# EAGLE design circuit_R1 (EAGLE 7.6.0)
REV: 1
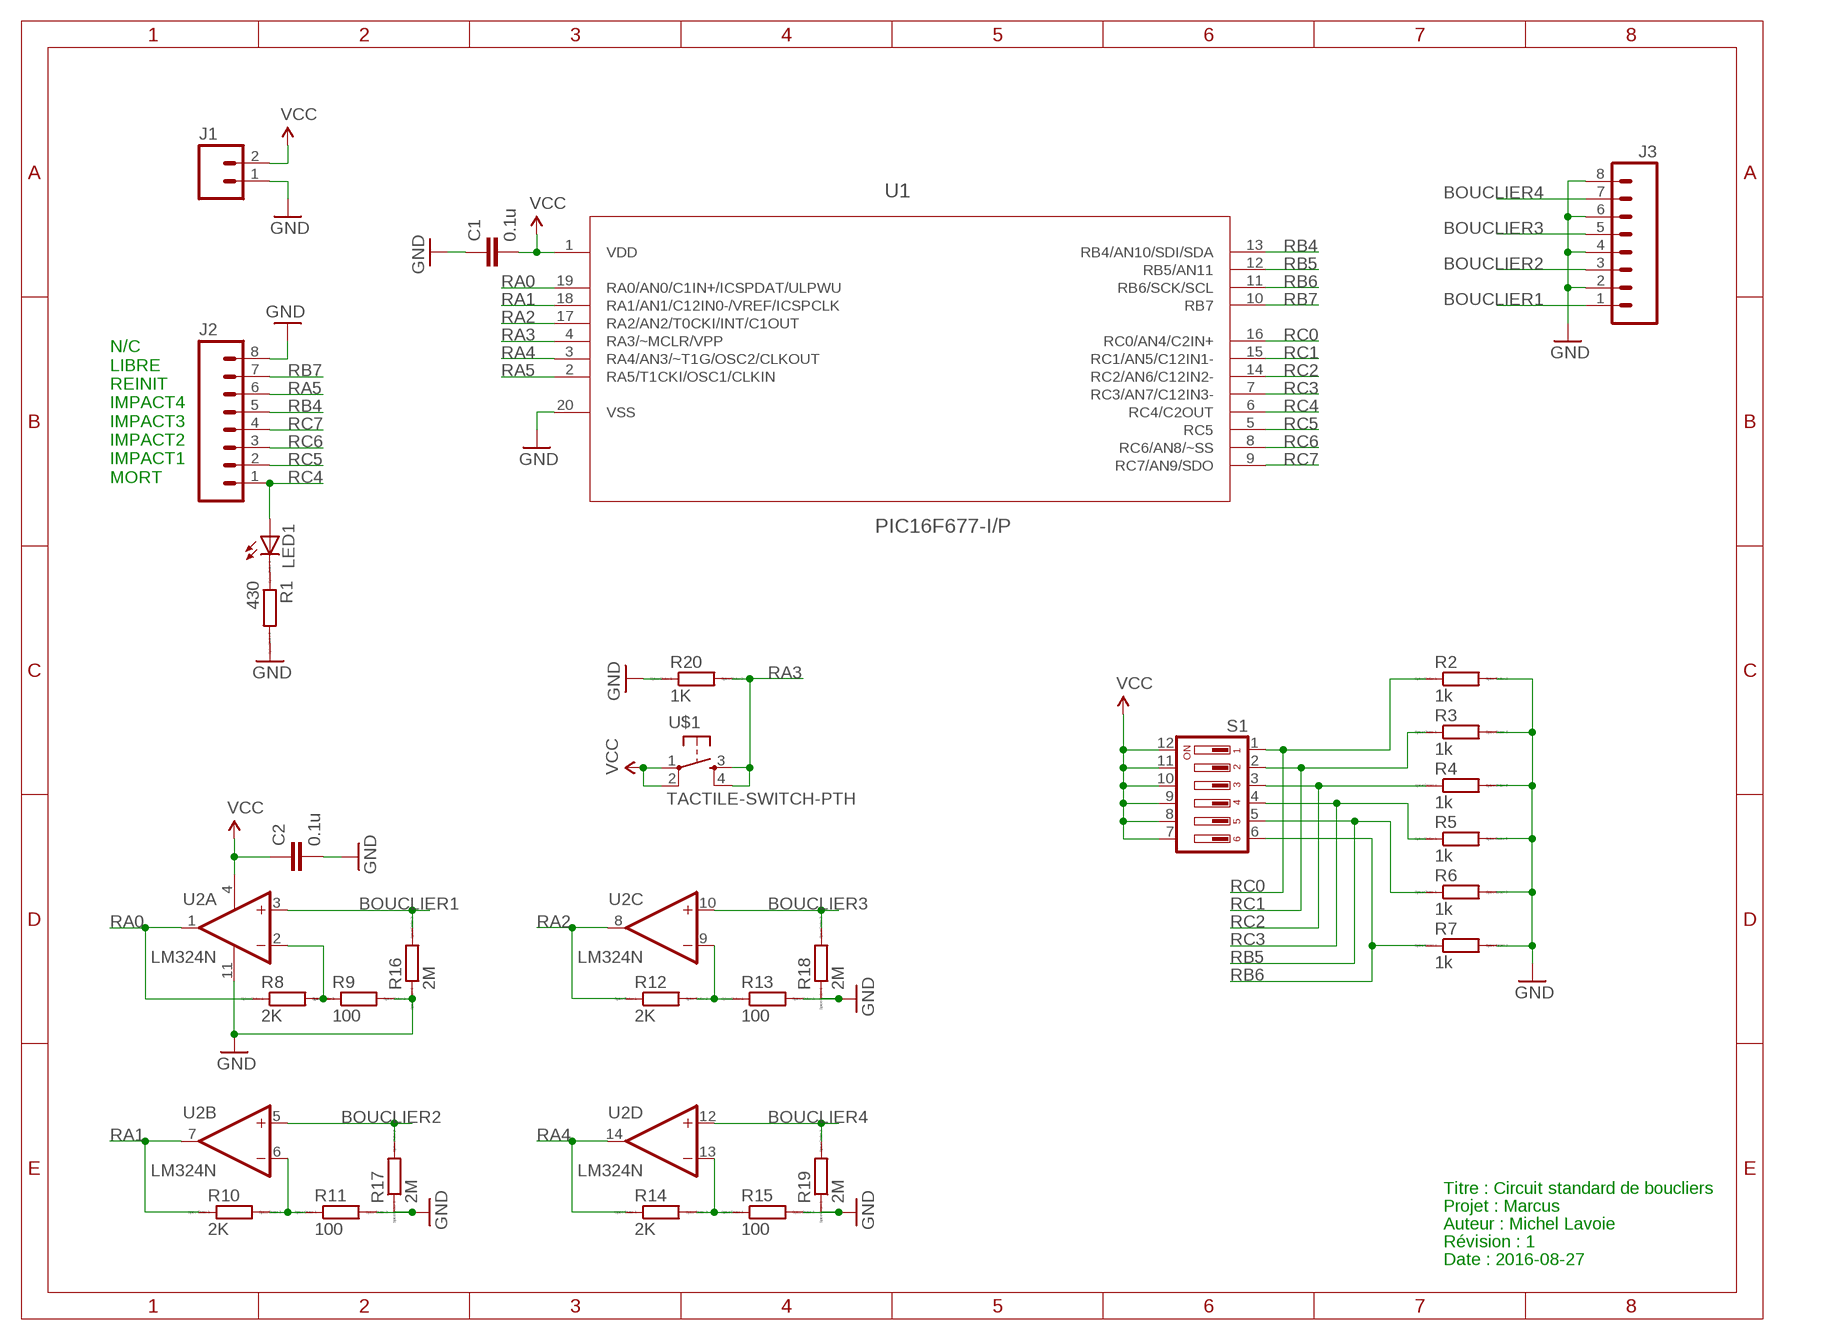
[diagram p0: schematic, sheet 1]

## Parts
C1  0.1u  CAPPTH  [CAP-PTH-SMALL]
C2  0.1u  CAPPTH  [CAP-PTH-SMALL]
J1  M02PTH  [1X02]
J2  M08NO_SILK  [1X08_PIN1_NO_SILK]
J3  M08NO_SILK  [1X08_PIN1_NO_SILK]
LED1  LED3MM  [LED3MM]
R1  430  R0207/10  [0207/10]
R2  1k  R0207/10  [0207/10]
R3  1k  R0207/10  [0207/10]
R4  1k  R0207/10  [0207/10]
R5  1k  R0207/10  [0207/10]
R6  1k  R0207/10  [0207/10]
R7  1k  R0207/10  [0207/10]
R8  2K  R0207/10  [0207/10]
R9  100  R0207/10  [0207/10]
R10  2K  R0207/10  [0207/10]
R11  100  R0207/10  [0207/10]
R12  2K  R0207/10  [0207/10]
R13  100  R0207/10  [0207/10]
R14  2K  R0207/10  [0207/10]
R15  100  R0207/10  [0207/10]
R16  2M  R0207/10  [0207/10]
R17  2M  R0207/10  [0207/10]
R18  2M  R0207/10  [0207/10]
R19  2M  R0207/10  [0207/10]
R20  1K  R0207/10  [0207/10]
S1  DIP06YL  [DIP06YL]
U1  PIC16F677-I/P  [DIP254P762X533-20]
U2  LM324N  [DIL14]
U$1  TACTILE-SWITCH-PTH  [TAC-SWITCH-PTH]

## Nets
5V: C1.2 C2.1 J1.2 S1.7 S1.8 S1.9 S1.10 S1.11 S1.12 U1.1(VDD) U2.4(P:V+) U$1.1 U$1.2 ; supply symbol labelled VCC
BOUCLIER1: J3.1 R16.2 U2.3(A:+IN)
BOUCLIER2: J3.3 R17.2 U2.5(B:+IN)
BOUCLIER3: J3.5 R18.2 U2.10(C:+IN)
BOUCLIER4: J3.7 R19.2 U2.12(D:+IN)
GND: C1.1 C2.2 J1.1 J2.8 J3.2 J3.4 J3.6 J3.8 R1.2 R2.2 R3.2 R4.2 R5.2 R6.2 R7.2 R9.2 R11.2 R13.2 R15.2 R16.1 R17.1 R18.1 R19.1 R20.1 U1.20(VSS) U2.11(P:V-)
N$1: R10.2 R11.1 U2.6(B:-IN)
N$2: LED1.K(C) R1.1
N$3: R8.2 R9.1 U2.2(A:-IN)
N$5: R12.2 R13.1 U2.9(C:-IN)
N$6: R14.2 R15.1 U2.13(D:-IN)
RA0: R8.1 U1.19(RA0/AN0/C1IN+/ICSPDAT/ULPWU) U2.1(A:OUT)
RA1: R10.1 U1.18(RA1/AN1/C12IN0-/VREF/ICSPCLK) U2.7(B:OUT)
RA2: R12.1 U1.17(RA2/AN2/T0CKI/INT/C1OUT) U2.8(C:OUT)
RA3: R20.2 U1.4(RA3/~MCLR/VPP) U$1.3 U$1.4
RA4: R14.1 U1.3(RA4/AN3/~T1G/OSC2/CLKOUT) U2.14(D:OUT)
RA5: J2.6 U1.2(RA5/T1CKI/OSC1/CLKIN)
RB4: J2.5 U1.13(RB4/AN10/SDI/SDA)
RB5: R6.1 S1.5 U1.12(RB5/AN11)
RB6: R7.1 S1.6 U1.11(RB6/SCK/SCL)
RB7: J2.7 U1.10(RB7)
RC0: R2.1 S1.1 U1.16(RC0/AN4/C2IN+)
RC1: R3.1 S1.2 U1.15(RC1/AN5/C12IN1-)
RC2: R4.1 S1.3 U1.14(RC2/AN6/C12IN2-)
RC3: R5.1 S1.4 U1.7(RC3/AN7/C12IN3-)
RC4: J2.1 LED1.A U1.6(RC4/C2OUT)
RC5: J2.2 U1.5(RC5)
RC6: J2.3 U1.8(RC6/AN8/~SS)
RC7: J2.4 U1.9(RC7/AN9/SDO)

## Notes on the sheet
- N/C
  LIBRE
  REINIT
  IMPACT4
  IMPACT3
  IMPACT2
  IMPACT1
  MORT
- Titre : Circuit standard de boucliers
- Projet : Marcus
- Auteur : Michel Lavoie
- Révision : 1
- Date : 2016-08-27

## Library data of the parts
C1 C2 = SparkFun-Capacitors:CAP: Capacitor Standard 0603 ceramic capacitor, and 0.1" leaded capacitor.
J1 = SparkFun-Connectors:M02: Standard 2-pin 0.1" header. Use with - straight break away headers ( PRT-00116) - right angle break away headers (PRT-00553) - swiss pins (PRT-00743) - machine pins (PRT-00117) - female headers (PRT-00115) Molex polarized connector foot print use with: PRT-08233 with associated crimp pins and housings. 2.54_SCREWTERM for use with PRT-10571. 3.5mm Screw Terminal footprints for PRT-08084 5mm Screw Terminal footprints for use with PRT-08432
J2 J3 = SparkFun-Connectors:M08: Header 8 Standard 8-pin 0.1" header. Use with straight break away headers (SKU : PRT-00116), right angle break away headers (PRT-00553), swiss pins (PRT-00743), machine pins (PRT-00117), and female headers (PRT-00115).
LED1 = adafruit:LED: LED OSRAM: - CHIPLED LG R971, LG N971, LY N971, LG Q971, LY Q971, LO R971, LY R971 LH N974, LH R974 LS Q976, LO Q976, LY Q976 LO Q996 - Hyper CHIPLED LW Q18S LB Q993, LB Q99A, LB R99A - SideLED LS A670, LO A670, LY A670, LG A670, LP A670 LB A673, LV A673, LT A673, LW A673 LH A674 LY A675 LS A676, LA A676, LO A676, LY A676, LW A676 LS A679, LY A679, LG A679 - Hyper Micro SIDELED® LS Y876, LA Y876, LO Y876, LY Y876 LT Y87S - SmartLED LW L88C, LW L88S LB L89C, LB L89S, LG L890 LS L89K, LO L89K, LY L89K LS L896, LA L896, LO L896, LY L896 - TOPLED LS T670, LO T670, LY T670, LG T670, LP T670 LSG T670, LSP T670, LSY T670, LOP T670, LYG T670 LG T671, LOG T671, LSG T671 LB T673, LV T673, LT T673, LW T673 LH T674 LS T676, LA T676, LO T676, LY T676, LB T676, LH T676, LSB T676, LW T676 LB T67C, LV T67C, LT T67C, LS T67K, LO T67K, LY T67K, LW E67C LS E67B, LA E67B, LO E67B, LY E67B, LB E67C, LV E67C, LT E67C LW T67C LS T679, LY T679, LG T679 LS T770, LO T770, LY T770, LG T770, LP T770 LB T773, LV T773, LT T773, LW T773 LH T774 LS E675, LA E675, LY E675, LS T675 LS T776, LA T776, LO T776, LY T776, LB T776 LHGB T686 LT T68C, LB T68C - Hyper Mini TOPLED® LB M676 - Mini TOPLED Santana® LG M470 LS M47K, LO M47K, LY M47K Source: http://www.osram.convergy.de/
R1-R20 = eagle-ltspice:R: RESISTOR, European symbol; SPICEMODEL: NONE; SPICEPREFIX: R
S1 = switch-dil:DIP06YL: DIL/CODE SWITCH; OC_FARNELL: unknown; OC_NEWARK: unknown
U1 = Microchip_By_element14_Batch_1:PIC16F677-I/P: 8 Bit CMOS Microcontrollers; MPN: PIC16F677-I/P; OC_FARNELL: 1332206; OC_NEWARK: 56J7509; PACKAGE: PDIP-20; SUPPLIER: Microchip
U2 = linear:LM324: OP AMP
U$1 = GeekAmmo:TACTILE-SWITCH: Tactile Switch 4 Pins, SPST NO

## Net classes
0 default: width 0.254 mm, clearance 0.305 mm

## Board
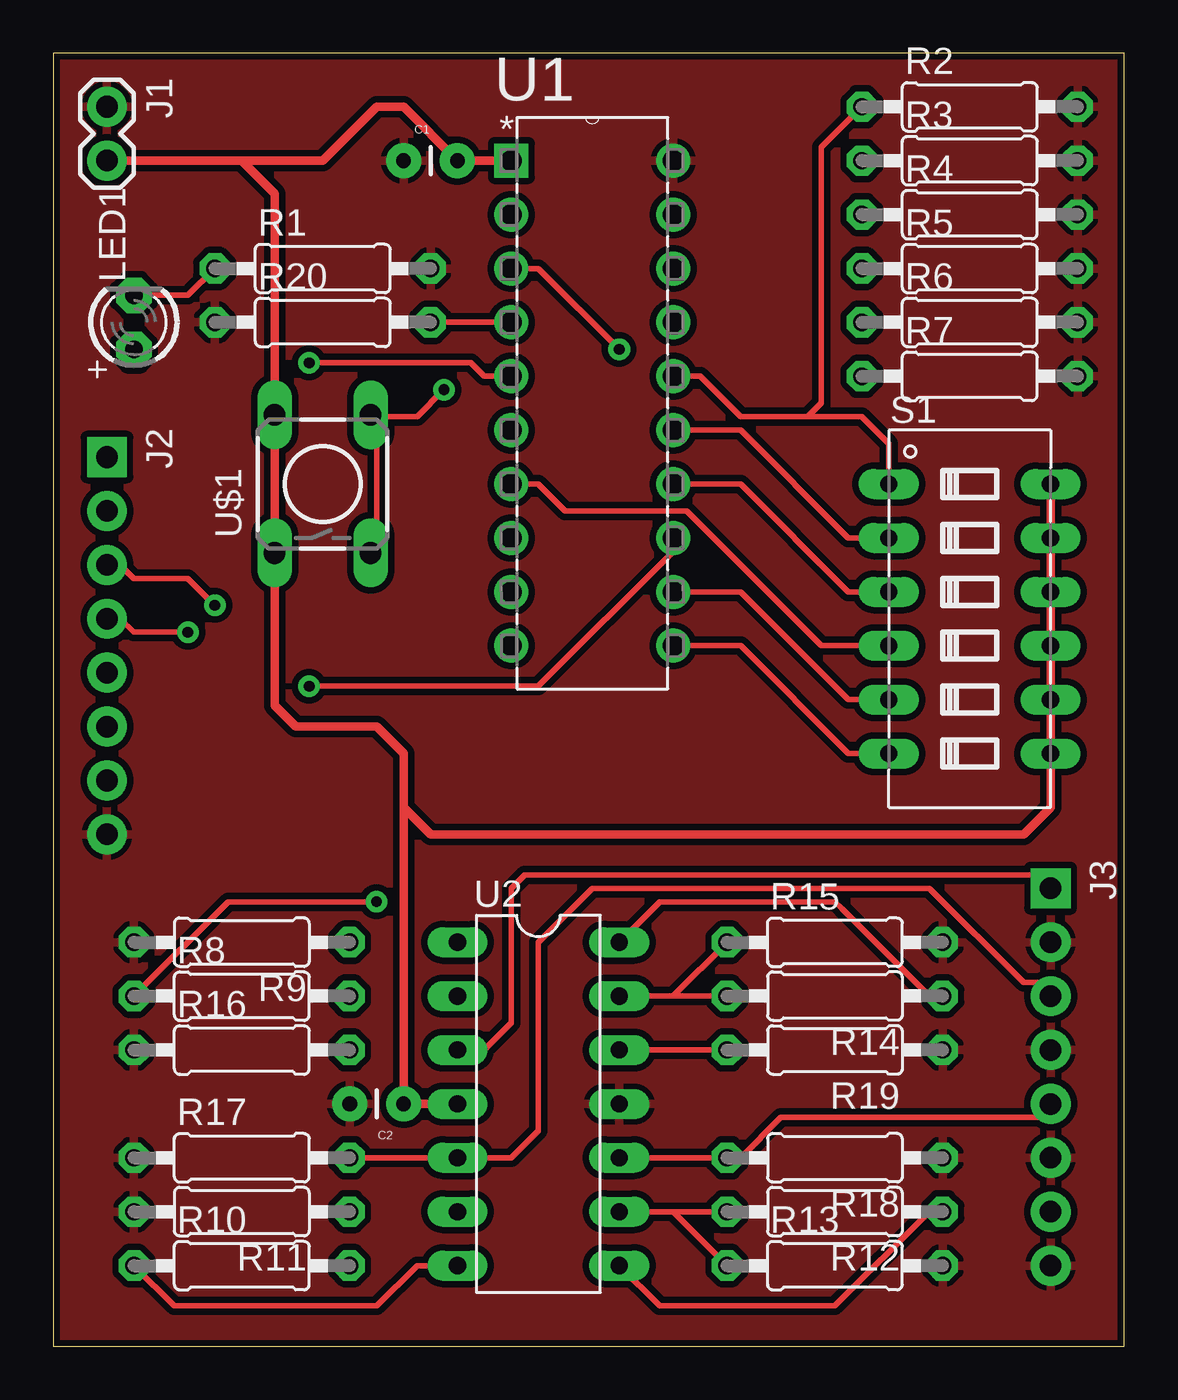
[diagram p1: board, top side]
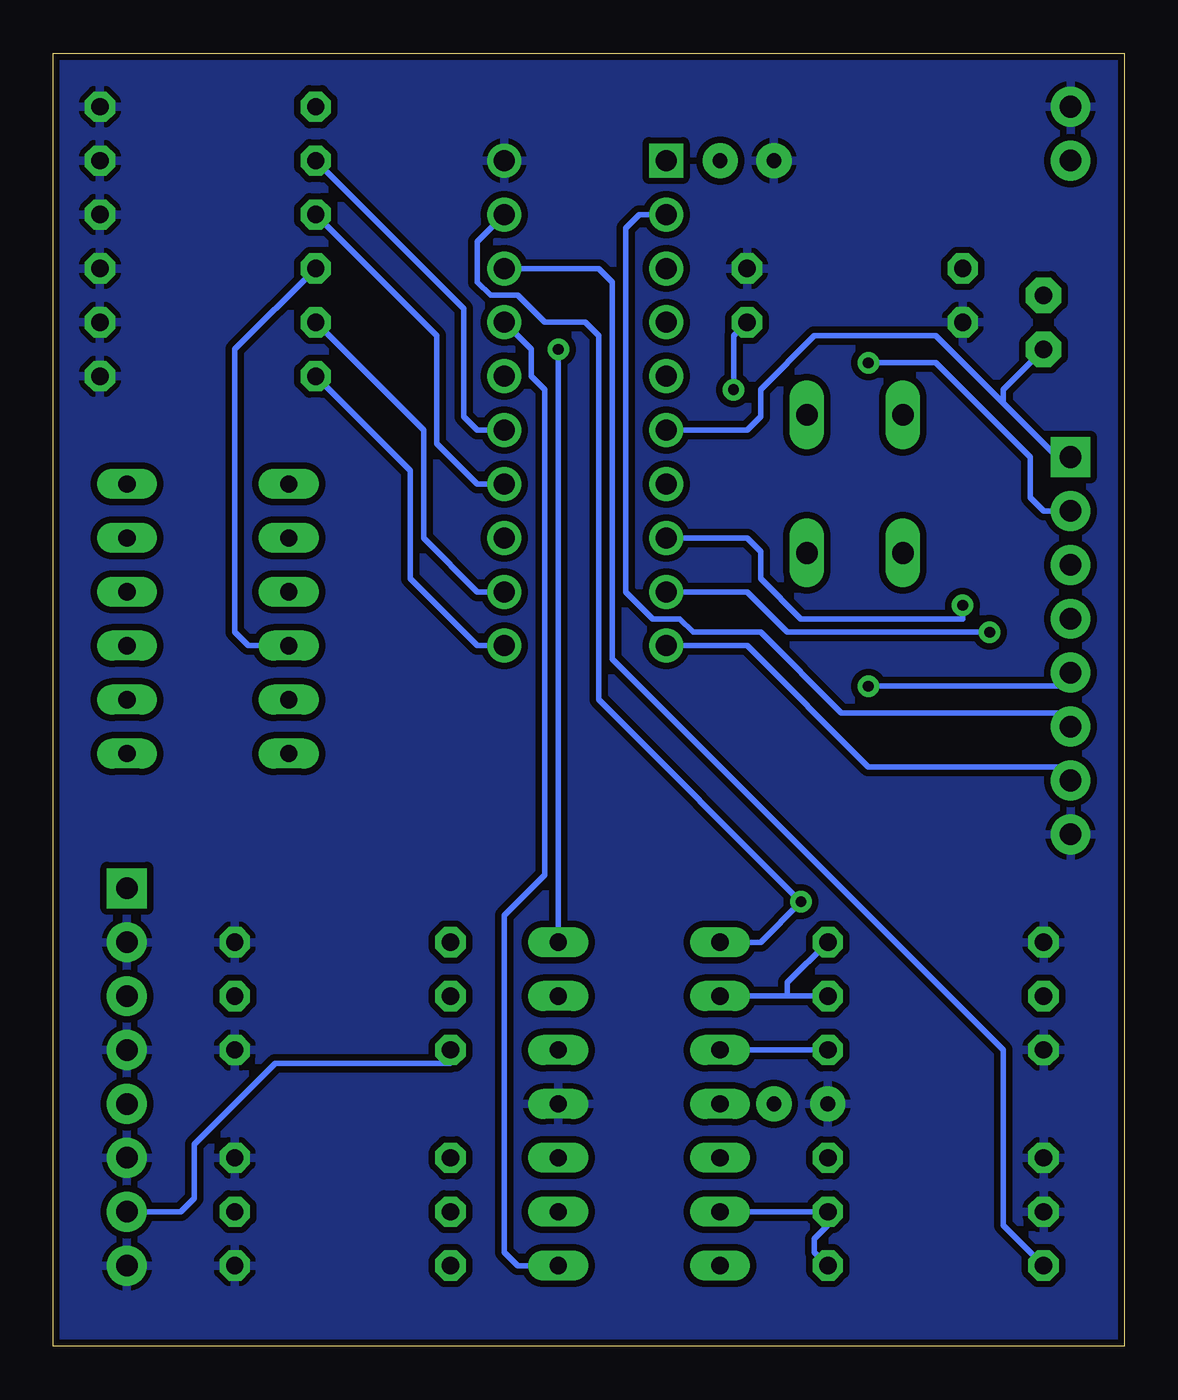
[diagram p2: board, bottom side, seen from below]

Size 50.47 x 60.95 mm. Coordinates in mm from the lower left corner, seen from the top.
Outline: 0,0 50.47,0 50.47,60.95 0,60.95 0,0
Copper layers (1*16): Top 0.035mm / dielectric 1.5mm / Bottom 0.035mm
Design rules "SparkFun": minimum track width 8mil, minimum drill 20mil, track to track 8mil, track to pad 8mil, pad to pad 8mil, via to via 8mil, smd to smd 8mil, copper to edge 8mil, drill to drill 8mil, minimum pad ring 12mil, minimum via ring 10mil, stop-mask expansion 4mil, vias tented up to drill 20mil, thermal gap 10mil

### Footprints (pad centres in the part's own frame; a part is rotated, then mirrored left to right if it is on the bottom)
CAP-PTH-SMALL = drill 0.7 pad 1.651: 1 0,0; 2 2.54,0
1X02 = drill 1.016 pad 1.88: 1 0,0; 2 2.54,0
1X08_PIN1_NO_SILK = drill 1.016 pad 1.88 square: 1 0,0 | drill 1.016 pad 1.88: 2 2.54,0; 3 5.08,0; 4 7.62,0; 5 10.16,0; 6 12.7,0; 7 15.24,0; 8 17.78,0
LED3MM = drill 0.813 pad 1.676 octagon: A -1.27,0; K 1.27,0
0207/10 = drill 0.813 octagon: 1 -5.08,0; 2 5.08,0
DIP06YL = drill 0.813 long: 1 -6.35,-3.81; 2 -3.81,-3.81; 3 -1.27,-3.81; 4 1.27,-3.81; 5 3.81,-3.81; 6 6.35,-3.81; 7 6.35,3.81; 8 3.81,3.81; 9 1.27,3.81; 10 -1.27,3.81; 11 -3.81,3.81; 12 -6.35,3.81
DIP254P762X533-20 = drill 0.991 square: 1 -7.62,22.86 | drill 0.991: 2 -7.62,20.32; 3 -7.62,17.78; 4 -7.62,15.24; 5 -7.62,12.7; 6 -7.62,10.16; 7 -7.62,7.62; 8 -7.62,5.08; 9 -7.62,2.54; 10 -7.62,0; 11 0,0; 12 0,2.54; 13 0,5.08; 14 0,7.62; 15 0,10.16; 16 0,12.7; 17 0,15.24; 18 0,17.78; 19 0,20.32; 20 0,22.86
DIL14 = drill 0.813 long: 1 -7.62,-3.81; 2 -5.08,-3.81; 3 -2.54,-3.81; 4 0,-3.81; 5 2.54,-3.81; 6 5.08,-3.81; 7 7.62,-3.81; 8 7.62,3.81; 9 5.08,3.81; 10 2.54,3.81; 11 0,3.81; 12 -2.54,3.81; 13 -5.08,3.81; 14 -7.62,3.81
TAC-SWITCH-PTH = drill 1.016 pad 1.524 long: 1 -3.251,2.261; 2 3.251,2.261; 3 -3.251,-2.261; 4 3.251,-2.261

### Placement (x,y rotation side)
C1  16.51,55.88 0 top
C2  16.51,11.43 180 top
J1  2.54,58.42 270 top
J2  2.54,41.91 270 top
J3  46.99,21.59 270 top
LED1  3.81,48.26 90 top
R1  12.7,50.8 0 top
R2  43.18,58.42 0 top
R3  43.18,55.88 0 top
R4  43.18,53.34 0 top
R5  43.18,50.8 0 top
R6  43.18,48.26 0 top
R7  43.18,45.72 0 top
R8  8.89,16.51 0 top
R9  8.89,19.05 180 top
R10  8.89,3.81 0 top
R11  8.89,6.35 180 top
R12  36.83,6.35 180 top
R13  36.83,3.81 0 top
R14  36.83,16.51 180 top
R15  36.83,19.05 0 top
R16  8.89,13.97 0 top
R17  8.89,8.89 0 top
R18  36.83,8.89 180 top
R19  36.83,13.97 180 top
R20  12.7,48.26 0 top
S1  43.18,34.29 270 top
U1  29.21,33.02 0 top
U2  22.86,11.43 270 top
U$1  12.7,40.64 90 top

### Tracks (layer width: path | path; a pad name or v marks a point on that pad's centre or on a via)
5V
  Top 0.406: J1.2 8.89,55.88 | 8.89,55.88 12.7,55.88 15.24,58.42 16.51,58.42 C1.2 U1.1 | 8.89,55.88 10.44,54.33 U$1.2 U$1.1 10.44,30.2 11.43,29.21 15.24,29.21 16.51,27.94 16.51,25.4 | 16.51,25.4 C2.1 U2.4 | 16.51,25.4 17.78,24.13 45.72,24.13 46.99,25.4 S1.7 S1.8 S1.9 S1.10 S1.11 S1.12
BOUCLIER1
  Top 0.254: J3.1 46.35,22.23 22.23,22.23 21.59,21.59 21.59,15.24 20.32,13.97 U2.3
  Bottom 0.254: U2.3 R16.2
BOUCLIER2
  Top 0.254: R17.2 U2.5 21.59,8.89 22.86,10.16 22.86,19.05 25.4,21.59 41.27,21.59 45.72,17.14 46.35,17.14 J3.3
BOUCLIER3
  Top 0.254: U2.10 R18.2 32.38,8.89 34.29,10.79 46.35,10.79 J3.5
BOUCLIER4
  Top 0.254: R19.2 U2.12
  Bottom 0.254: R19.2 31.75,13.34 40.01,13.34 43.81,9.53 43.81,6.99 44.45,6.35 J3.7
GND
  pour Top (isolate 0.305): 0,60.96 50.8,60.96 50.8,0 0,0
  pour Bottom (isolate 0.305): 0,0 0,60.96 50.8,60.96 50.8,0
N$1
  Bottom 0.254: R10.2 14.61,4.45 14.61,5.08 13.97,5.71 R11.1 U2.6
N$2
  Top 0.254: R1.1 6.35,49.53 LED1.K
N$3
  Bottom 0.254: U2.2 15.88,16.51 | 15.88,16.51 R8.2 | R9.1 15.88,17.14 15.88,16.51
N$5
  Top 0.254: R12.2 29.21,6.35 | 29.21,6.35 U2.9 | 29.21,6.35 R13.1
N$6
  Top 0.254: R14.2 29.21,16.51 | 29.21,16.51 U2.13 | 29.21,16.51 R15.1
RA0  (via drill 0.51)
  Top 0.254: R8.1 8.26,20.95 v15.24,20.95
  Bottom 0.254: U2.1 17.14,19.05 v15.24,20.95 24.77,30.48 24.77,47.62 25.4,48.26 27.3,48.26 28.57,49.53 29.84,49.53 30.48,50.16 30.48,52.07 U1.19
RA1
  Top 0.254: R10.1 5.71,1.91 15.24,1.91 17.14,3.81 U2.7
  Bottom 0.254: U1.18 24.77,50.8 24.13,50.16 24.13,32.38 5.71,13.97 5.71,5.71 R10.1
RA2
  Top 0.254: R12.1 41.27,6.35 36.83,1.91 28.57,1.91 U2.8
  Bottom 0.254: U1.17 27.94,46.99 27.94,45.72 27.3,45.09 27.3,22.23 29.21,20.32 29.21,4.45 28.57,3.81 U2.8
RA3  (via drill 0.51)
  Top 0.254: U1.4 R20.2 | 15.24,43.81 15.24,37.47 U$1.3 | v18.41,45.09 17.14,43.81 15.24,43.81 | 15.24,43.81 U$1.4
  Bottom 0.254: R20.2 18.41,47.62 v18.41,45.09
RA4  (via drill 0.51)
  Top 0.254: R14.1 41.27,16.51 37.15,20.64 36.83,20.95 28.57,20.95 U2.14 | U1.3 22.86,50.8 v26.67,46.99
  Bottom 0.254: U2.14 v26.67,46.99
RA5
  Bottom 0.254: U1.2 22.86,53.34 23.5,52.7 23.5,35.56 22.23,34.29 20.95,34.29 20.32,33.66 17.14,33.66 13.34,29.84 2.54,29.84 J2.6
RB4  (via drill 0.51)
  Top 0.254: v12.06,31.11 22.86,31.11 29.21,37.47 U1.13
  Bottom 0.254: v12.06,31.11 2.54,31.11 J2.5
RB5
  Top 0.254: S1.5 37.47,30.48 32.38,35.56 U1.12
  Bottom 0.254: R6.1 33.02,43.18 33.02,38.1 30.48,35.56 U1.12
RB6
  Top 0.254: S1.6 37.47,27.94 32.38,33.02 U1.11
  Bottom 0.254: R7.1 33.66,41.27 33.66,36.2 30.48,33.02 U1.11
RB7
  Bottom 0.254: U1.10 17.78,33.02 12.06,27.3 2.54,27.3 J2.7
RC0
  Top 0.254: S1.1 39.37,42.55 38.1,43.81 35.56,43.81 | 35.56,43.81 32.38,43.81 30.48,45.72 U1.16 | R2.1 36.2,56.52 36.2,44.45 35.56,43.81
RC1
  Top 0.254: S1.2 37.47,38.1 32.38,43.18 U1.15
  Bottom 0.254: R3.1 31.11,48.9 31.11,43.81 30.48,43.18 U1.15
RC2
  Top 0.254: S1.3 37.47,35.56 32.38,40.64 U1.14
  Bottom 0.254: R4.1 32.38,47.62 32.38,42.55 30.48,40.64 U1.14
RC3
  Top 0.254: U1.7 22.86,40.64 24.13,39.37 29.84,39.37 36.2,33.02 S1.4
  Bottom 0.254: S1.4 41.27,33.02 41.91,33.66 41.91,46.99 R5.1
RC4
  Bottom 0.254: U1.6 17.78,43.18 17.14,43.81 17.14,45.09 14.61,47.62 8.89,47.62 5.71,44.45 | 5.71,44.45 3.17,41.91 J2.1 | LED1.A 5.71,45.09 5.71,44.45
RC5  (via drill 0.51)
  Top 0.254: U1.5 20.32,45.72 19.68,46.35 v12.06,46.35
  Bottom 0.254: v12.06,46.35 8.89,46.35 4.45,41.91 4.45,40.01 3.81,39.37 J2.2
RC6  (via drill 0.51)
  Top 0.254: v7.62,34.92 6.35,36.2 3.81,36.2 3.17,36.83 J2.3
  Bottom 0.254: U1.8 17.78,38.1 17.14,37.47 17.14,36.2 15.24,34.29 7.62,34.29 v7.62,34.92
RC7  (via drill 0.51)
  Top 0.254: v6.35,33.66 3.81,33.66 3.17,34.29 J2.4
  Bottom 0.254: U1.9 17.78,35.56 15.88,33.66 v6.35,33.66